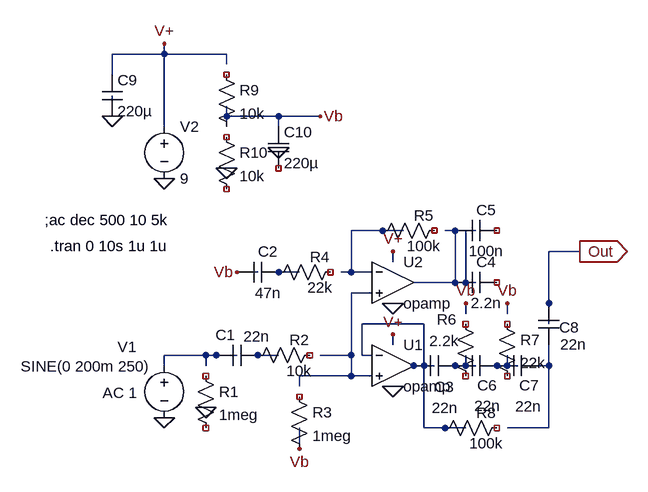
[diagram p0: schematic SansAmpGT2.asc]
SansAmpGT2.asc, the LTspice schematic file:
Version 4
SHEET 1 1212 680
WIRE 112 -304 112 -320
WIRE 112 -304 32 -304
WIRE 208 -304 112 -304
WIRE 208 -288 208 -304
WIRE 32 -272 32 -304
WIRE 32 -208 32 -240
WIRE 208 -208 208 -224
WIRE 288 -208 208 -208
WIRE 352 -208 288 -208
WIRE 112 -192 112 -304
WIRE 208 -192 208 -208
WIRE 288 -192 288 -208
WIRE 480 -32 400 -32
WIRE 560 -32 544 -32
WIRE 592 -32 576 -32
WIRE 752 0 704 0
WIRE 464 16 464 0
WIRE 256 32 224 32
WIRE 320 32 288 32
WIRE 400 32 400 -32
WIRE 400 32 384 32
WIRE 432 32 400 32
WIRE 560 48 560 -32
WIRE 560 48 496 48
WIRE 576 48 576 -32
WIRE 576 48 560 48
WIRE 592 48 576 48
WIRE 432 64 400 64
WIRE 576 96 576 80
WIRE 640 96 640 80
WIRE 512 112 416 112
WIRE 704 112 704 0
WIRE 464 144 464 128
WIRE 176 160 112 160
WIRE 224 160 176 160
WIRE 288 160 256 160
WIRE 400 160 400 64
WIRE 400 160 352 160
WIRE 416 160 416 112
WIRE 432 160 416 160
WIRE 112 176 112 160
WIRE 176 176 176 160
WIRE 512 176 512 112
WIRE 512 176 496 176
WIRE 528 176 512 176
WIRE 576 176 576 160
WIRE 576 176 560 176
WIRE 592 176 576 176
WIRE 640 176 640 160
WIRE 640 176 624 176
WIRE 656 176 640 176
WIRE 704 176 704 144
WIRE 704 176 688 176
WIRE 400 192 400 160
WIRE 400 192 320 192
WIRE 432 192 400 192
WIRE 320 208 320 192
WIRE 512 272 512 176
WIRE 576 272 512 272
WIRE 704 272 704 176
WIRE 704 272 640 272
WIRE 320 304 320 272
FLAG 112 256 0
FLAG 176 240 0
FLAG 320 304 Vb
FLAG 464 208 0
FLAG 224 32 Vb
FLAG 464 80 0
FLAG 464 128 V+
FLAG 464 0 V+
FLAG 576 80 Vb
FLAG 640 80 Vb
FLAG 112 -112 0
FLAG 208 -128 0
FLAG 288 -160 0
FLAG 32 -208 0
FLAG 112 -320 V+
FLAG 352 -208 Vb
FLAG 752 0 Out
IOPIN 752 0 Out
SYMBOL voltage 112 160 R0
WINDOW 0 -72 -13 Left 0
WINDOW 3 -221 17 Left 0
WINDOW 123 -95 58 Left 0
WINDOW 39 0 0 Left 0
SYMATTR InstName V1
SYMATTR Value SINE(0 200m 250)
SYMATTR Value2 AC 1
SYMBOL voltage 112 -208 R0
WINDOW 123 0 0 Left 0
WINDOW 39 0 0 Left 0
SYMATTR InstName V2
SYMATTR Value 9
SYMBOL cap 256 144 R90
WINDOW 0 0 50 VBottom 0
WINDOW 3 -29 2 VTop 0
SYMATTR InstName C1
SYMATTR Value 22n
SYMBOL res 160 176 R0
SYMATTR InstName R1
SYMATTR Value 1meg
SYMBOL res 352 144 R90
WINDOW 0 8 32 VBottom 0
WINDOW 3 24 32 VTop 0
SYMATTR InstName R2
SYMATTR Value 10k
SYMBOL Opamps\\opamp 464 112 R0
SYMATTR InstName U1
SYMBOL res 304 208 R0
SYMATTR InstName R3
SYMATTR Value 1meg
SYMBOL Opamps\\opamp 464 -16 R0
SYMATTR InstName U2
SYMBOL res 384 16 R90
WINDOW 0 8 32 VBottom 0
WINDOW 3 24 32 VTop 0
SYMATTR InstName R4
SYMATTR Value 22k
SYMBOL cap 288 16 R90
WINDOW 0 0 16 VBottom 0
WINDOW 3 32 16 VTop 0
SYMATTR InstName C2
SYMATTR Value 47n
SYMBOL res 544 -48 R90
WINDOW 0 8 32 VBottom 0
WINDOW 3 24 32 VTop 0
SYMATTR InstName R5
SYMATTR Value 100k
SYMBOL cap 560 160 R90
WINDOW 0 64 17 VBottom 0
WINDOW 3 65 16 VTop 0
SYMATTR InstName C3
SYMATTR Value 22n
SYMBOL cap 624 32 R90
WINDOW 0 0 16 VBottom 0
WINDOW 3 32 16 VTop 0
SYMATTR InstName C4
SYMATTR Value 2.2n
SYMBOL cap 624 -48 R90
WINDOW 0 0 16 VBottom 0
WINDOW 3 32 16 VTop 0
SYMATTR InstName C5
SYMATTR Value 100n
SYMBOL cap 624 160 R90
WINDOW 0 62 15 VBottom 0
WINDOW 3 62 14 VTop 0
SYMATTR InstName C6
SYMATTR Value 22n
SYMBOL cap 688 160 R90
WINDOW 0 62 14 VBottom 0
WINDOW 3 63 15 VTop 0
SYMATTR InstName C7
SYMATTR Value 22n
SYMBOL cap 720 144 R180
WINDOW 0 -31 27 Left 0
WINDOW 3 -42 1 Left 0
SYMATTR InstName C8
SYMATTR Value 22n
SYMBOL res 560 96 R0
WINDOW 0 -28 9 Left 0
WINDOW 3 -40 42 Left 0
SYMATTR InstName R6
SYMATTR Value 2.2k
SYMBOL res 624 96 R0
SYMATTR InstName R7
SYMATTR Value 22k
SYMBOL res 640 256 R90
WINDOW 0 8 32 VBottom 0
WINDOW 3 24 32 VTop 0
SYMATTR InstName R8
SYMATTR Value 100k
SYMBOL res 192 -288 R0
SYMATTR InstName R9
SYMATTR Value 10k
SYMBOL res 192 -192 R0
SYMATTR InstName R10
SYMATTR Value 10k
SYMBOL cap 16 -272 R0
SYMATTR InstName C9
SYMATTR Value 220µ
SYMBOL cap 272 -192 R0
SYMATTR InstName C10
SYMATTR Value 220µ
TEXT -72 -48 Left 0 !;ac dec 500 10 5k
TEXT -64 -8 Left 0 !.tran 0 10s 1u 1u

The netlist it stands for:
* SansAmpGT2.asc
V1 N006 0 SINE(0 200m 250) AC 1
V2 V+ 0 9
C1 N007 N006 22n
R1 NC_01 NC_02 1meg
R2 NC_03 N007 10k
XU1 N005 N004 N005 opamp Aol=100K GBW=10Meg  ; pins invin noninvin out
R3 NC_04 Vb 1meg
XU2 N001 N004 N002 opamp Aol=100K GBW=10Meg  ; pins invin noninvin out
R4 NC_05 N003 22k
C2 N003 Vb 47n
R5 NC_06 N001 100k
C3 N008 N005 22n
C4 NC_07 N002 2.2n
C5 NC_08 N002 100n
C6 N009 N008 22n
C7 N010 N009 22n
C8 N010 Out 22n
R6 NC_09 NC_10 2.2k
R7 NC_11 NC_12 22k
R8 NC_13 N005 100k
R9 NC_14 Vb 10k
R10 NC_15 NC_16 10k
C9 V+ 0 220µ
C10 Vb NC_17 220µ
;ac dec 500 10 5k
.tran 0 10s 1u 1u
.backanno
.end